# EAGLE design Panel (EAGLE 7.6.0)
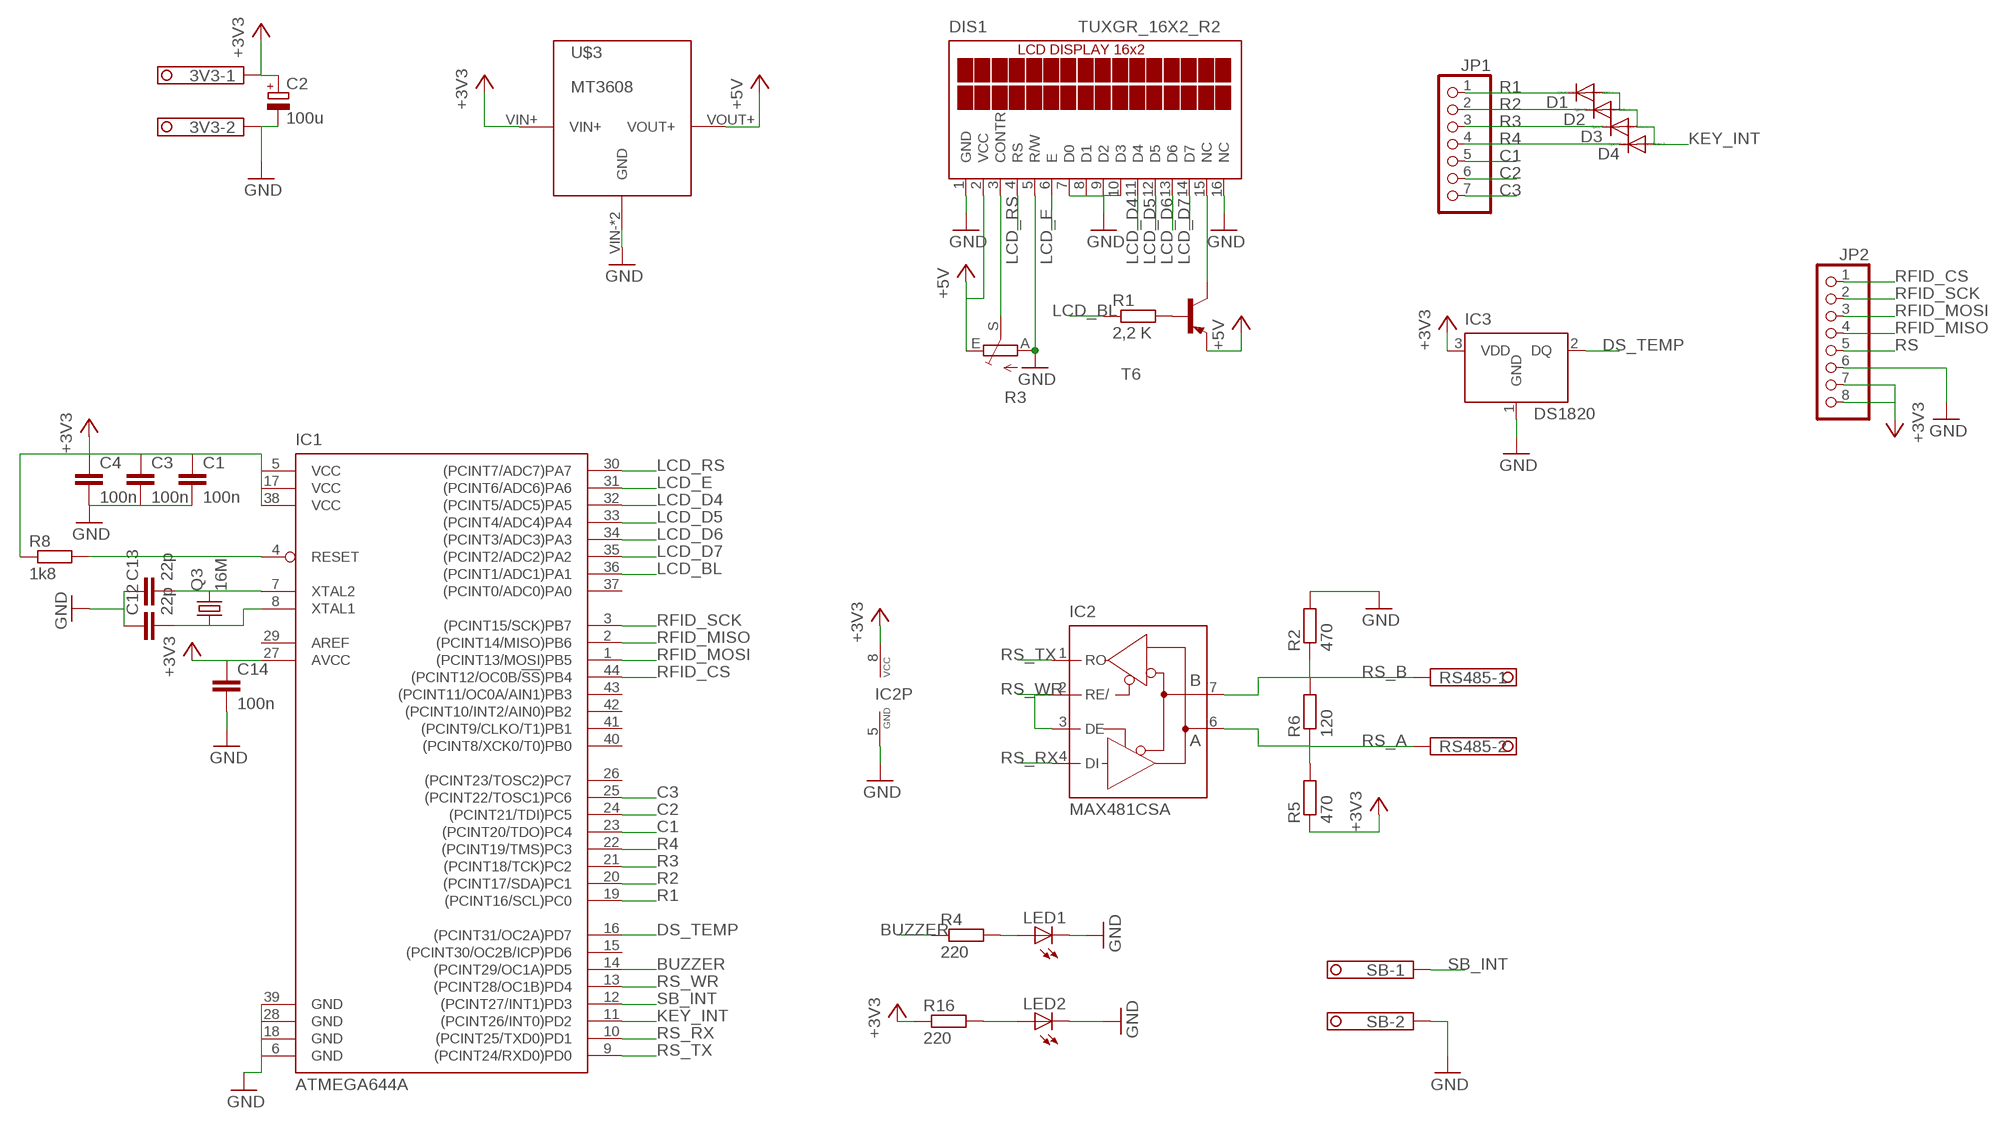
[diagram p0: schematic, sheet 1]

## Parts
3V3  1751248  [1751248]
C1  100n  C-EUC2012  [C2012]
C2  100u  CPOL-EUE2,5-6E  [E2,5-6E]
C3  100n  C-EUC2012  [C2012]
C4  100n  C-EUC2012  [C2012]
C12  22p  C-EU050-024X044  [C050-024X044]
C13  22p  C-EU050-024X044  [C050-024X044]
C14  100n  C-EUC2012  [C2012]
D1  BAS15  [DO34-7]
D2  BAS15  [DO34-7]
D3  BAS15  [DO34-7]
D4  BAS15  [DO34-7]
DIS1  TUXGR_16X2_R2  [TUXGR_16X2_R2]
IC1  ATMEGA644A  [TQFP44]
IC2  MAX481CSA  [SO08]
IC3  DS1820  [TO-92-]
JP1  PINHD-1X7  [1X07]
JP2  PINHD-1X8  [1X08]
LED1  LED3MM  [LED3MM]
LED2  LED3MM  [LED3MM]
Q3  16M  CRYSTALHC49U-V  [HC49U-V]
R1  2,2 K  R-EU_0204/7  [0204/7]
R2  470  R-EU_0204/5  [0204/5]
R3  TRIM_EU-CA6V  [CA6V]
R4  220  R-EU_0204/7  [0204/7]
R5  470  R-EU_0204/5  [0204/5]
R6  120  R-EU_0204/7  [0204/7]
R8  1k8  R-EU_0204/7  [0204/7]
R16  220  R-EU_0204/7  [0204/7]
RS485  1751248  [1751248]
SB  1751248  [1751248]
T6  BC327-40-PNP-TO92-EBC  [TO92-EBC]
U$3  MT3608  [MT3608]

## Nets
+3V3: 3V3.1 C1.1 C2.+ C3.1 C4.1 C14.1 IC1.5(VCC) IC1.17(VCC) IC1.27(AVCC) IC1.38(VCC) IC2.8(VCC) IC3.3(VDD) JP2.7 JP2.8 R5.1 R8.1 R16.1 U$3.VIN+
+5V: DIS1.2(VCC) R3.E T6.E U$3.VOUT+
BUZZER: IC1.14((PCINT29/OC1A)PD5) R4.1
C1: IC1.23((PCINT20/TDO)PC4) JP1.5
C2: IC1.24((PCINT21/TDI)PC5) JP1.6
C3: IC1.25((PCINT22/TOSC1)PC6) JP1.7
DS_TEMP: IC1.16((PCINT31/OC2A)PD7) IC3.2(DQ)
GND: 3V3.2 C1.2 C2.- C3.2 C4.2 C12.1 C13.1 C14.2 DIS1.1(GND) DIS1.5(R/W) DIS1.7(D0) DIS1.8(D1) DIS1.9(D2) DIS1.10(D3) DIS1.16(NC) IC1.6(GND) IC1.18(GND) IC1.28(GND) IC1.39(GND) IC2.5(GND) IC3.1(GND) JP2.6 LED1.K(C) LED2.K(C) R2.2 R3.A SB.2 U$3.VIN-(GND) U$3.VOUT-(GND)
KEY_INT: D1.A D2.A D3.A D4.A IC1.11((PCINT26/INT0)PD2)
LCD_BL: IC1.36((PCINT1/ADC1)PA1) R1.1
LCD_D4: DIS1.11(D4) IC1.32((PCINT5/ADC5)PA5)
LCD_D5: DIS1.12(D5) IC1.33((PCINT4/ADC4)PA4)
LCD_D6: DIS1.13(D6) IC1.34((PCINT3/ADC3)PA3)
LCD_D7: DIS1.14(D7) IC1.35((PCINT2/ADC2)PA2)
LCD_E: DIS1.6(E) IC1.31((PCINT6/ADC6)PA6)
LCD_RS: DIS1.4(RS) IC1.30((PCINT7/ADC7)PA7)
N$1: C12.2 IC1.8(XTAL1) Q3.1
N$2: R1.2 T6.B
N$3: LED1.A R4.2
N$4: C13.2 IC1.7(XTAL2) Q3.2
N$9: DIS1.3(CONTR) R3.S
N$22: DIS1.15(NC) T6.C
N$52: LED2.A R16.2
R1: D1.C IC1.19((PCINT16/SCL)PC0) JP1.1
R2: D2.C IC1.20((PCINT17/SDA)PC1) JP1.2
R3: D3.C IC1.21((PCINT18/TCK)PC2) JP1.3
R4: D4.C IC1.22((PCINT19/TMS)PC3) JP1.4
RFID_CS: IC1.44((PCINT12/OC0B/!SS!)PB4) JP2.1
RFID_MISO: IC1.2((PCINT14/MISO)PB6) JP2.4
RFID_MOSI: IC1.1((PCINT13/MOSI)PB5) JP2.3
RFID_SCK: IC1.3((PCINT15/SCK)PB7) JP2.2
RS: IC1.4(RESET) JP2.5 R8.2
RS_A: IC2.6(A) R5.2 R6.1 RS485.2
RS_B: IC2.7(B) R2.1 R6.2 RS485.1
RS_RX: IC1.10((PCINT25/TXD0)PD1) IC2.4(DI)
RS_TX: IC1.9((PCINT24/RXD0)PD0) IC2.1(RO)
RS_WR: IC1.13((PCINT28/OC1B)PD4) IC2.2(RE/) IC2.3(DE)
SB_INT: IC1.12((PCINT27/INT1)PD3) SB.1
Unconnected: IC1.15((PCINT30/OC2B/ICP)PD6) IC1.26((PCINT23/TOSC2)PC7) IC1.29(AREF) IC1.37((PCINT0/ADC0)PA0) IC1.40((PCINT8/XCK0/T0)PB0) IC1.41((PCINT9/CLKO/T1)PB1) IC1.42((PCINT10/INT2/AIN0)PB2) IC1.43((PCINT11/OC0A/AIN1)PB3)

## Library data of the parts
3V3 RS485 SB = con-phoenix-350:1751248: MKDS 1/ 2-3,5 Printklemme Nennstrom: 10 A Bemessungsspannung: 160 V Raster: 3,5 mm Polzahl: 2 Montageart: Löten Anschlussart: Schraubanschluss Anschlussrichtung vom Leiter zur Platine: 0° Source: http://eshop.phoenixcontact.com .. 1751248.pdf; OC_FARNELL: unknown; OC_NEWARK: unknown
C1 C3 C4 C14 = resistor:C-EU: CAPACITOR, European symbol
C2 = resistor:CPOL-EU: POLARIZED CAPACITOR, European symbol
C12 C13 = rcl:C-EU: CAPACITOR, European symbol
D1-D4 = diode:BAS15: DIODE high speed
DIS1 = display-lcd:TUXGR_16X2_R2: Tuxgraphics LCD display 16x2 characters reflective, without background light Source: tuxgr_12x2_r2.pdf; OC_FARNELL: unknown; OC_NEWARK: unknown
IC1 = atmel:ATMEGA644: 8-bit Microcontroller with 64K Bytes In-System Programmable Flash Source: http://www.atmel.com/dyn/resources/prod_documents/doc2593.pdf; MPN: ATMEGA644PV-10AU; OC_FARNELL: 1455123; OC_NEWARK: 58M3748
IC2 = maxim:MAX481CSA: RS485 TRANSEIVER; MF: MAXIM; MPN: MAX481CSA; OC_FARNELL: unknown; OC_NEWARK: 90C3817
IC3 = DS1820:DS1820: DS1820 - 1-Wire Digital Thermometer
JP1 = pinhead:PINHD-1X7: PIN HEADER
JP2 = pinhead:PINHD-1X8: PIN HEADER
LED1 LED2 = led:LED: LED OSRAM: - CHIPLED LG R971, LG N971, LY N971, LG Q971, LY Q971, LO R971, LY R971 LH N974, LH R974 LS Q976, LO Q976, LY Q976 LO Q996 - Hyper CHIPLED LW Q18S LB Q993, LB Q99A, LB R99A - SideLED LS A670, LO A670, LY A670, LG A670, LP A670 LB A673, LV A673, LT A673, LW A673 LH A674 LY A675 LS A676, LA A676, LO A676, LY A676, LW A676 LS A679, LY A679, LG A679 - Hyper Micro SIDELED® LS Y876, LA Y876, LO Y876, LY Y876 LT Y87S - SmartLED LW L88C, LW L88S LB L89C, LB L89S, LG L890 LS L89K, LO L89K, LY L89K LS L896, LA L896, LO L896, LY L896 - TOPLED LS T670, LO T670, LY T670, LG T670, LP T670 LSG T670, LSP T670, LSY T670, LOP T670, LYG T670 LG T671, LOG T671, LSG T671 LB T673, LV T673, LT T673, LW T673 LH T674 LS T676, LA T676, LO T676, LY T676, LB T676, LH T676, LSB T676, LW T676 LB T67C, LV T67C, LT T67C, LS T67K, LO T67K, LY T67K, LW E67C LS E67B, LA E67B, LO E67B, LY E67B, LB E67C, LV E67C, LT E67C LW T67C LS T679, LY T679, LG T679 LS T770, LO T770, LY T770, LG T770, LP T770 LB T773, LV T773, LT T773, LW T773 LH T774 LS E675, LA E675, LY E675, LS T675 LS T776, LA T776, LO T776, LY T776, LB T776 LHGB T686 LT T68C, LB T68C - Hyper Mini TOPLED® LB M676 - Mini TOPLED Santana® LG M470 LS M47K, LO M47K, LY M47K Source: http://www.osram.convergy.de LUXEON: - LUMILED® LXK2-PW12-R00, LXK2-PW12-S00, LXK2-PW14-U00, LXK2-PW14-V00 LXK2-PM12-R00, LXK2-PM12-S00, LXK2-PM14-U00 LXK2-PE12-Q00, LXK2-PE12-R00, LXK2-PE12-S00, LXK2-PE14-T00, LXK2-PE14-U00 LXK2-PB12-K00, LXK2-PB12-L00, LXK2-PB12-M00, LXK2-PB14-N00, LXK2-PB14-P00, LXK2-PB14-Q00 LXK2-PR12-L00, LXK2-PR12-M00, LXK2-PR14-Q00, LXK2-PR14-R00 LXK2-PD12-Q00, LXK2-PD12-R00, LXK2-PD12-S00 LXK2-PH12-R00, LXK2-PH12-S00 LXK2-PL12-P00, LXK2-PL12-Q00, LXK2-PL12-R00 Source: www.luxeon.com KINGBRIGHT: KA-3528ASYC Source: www.kingbright.com
Q3 = crystal:CRYSTAL: CRYSTAL; OC_FARNELL: 1666969; OC_NEWARK: unknown
R1 R2 R4-R6 R8 R16 = resistor:R-EU_: RESISTOR, European symbol
R3 = pot:TRIM_EU-: POTENTIOMETER
T6 = transistor:*-PNP-: PNP Transistror
U$3 = dc-dc-converter2:MT3608

## Board
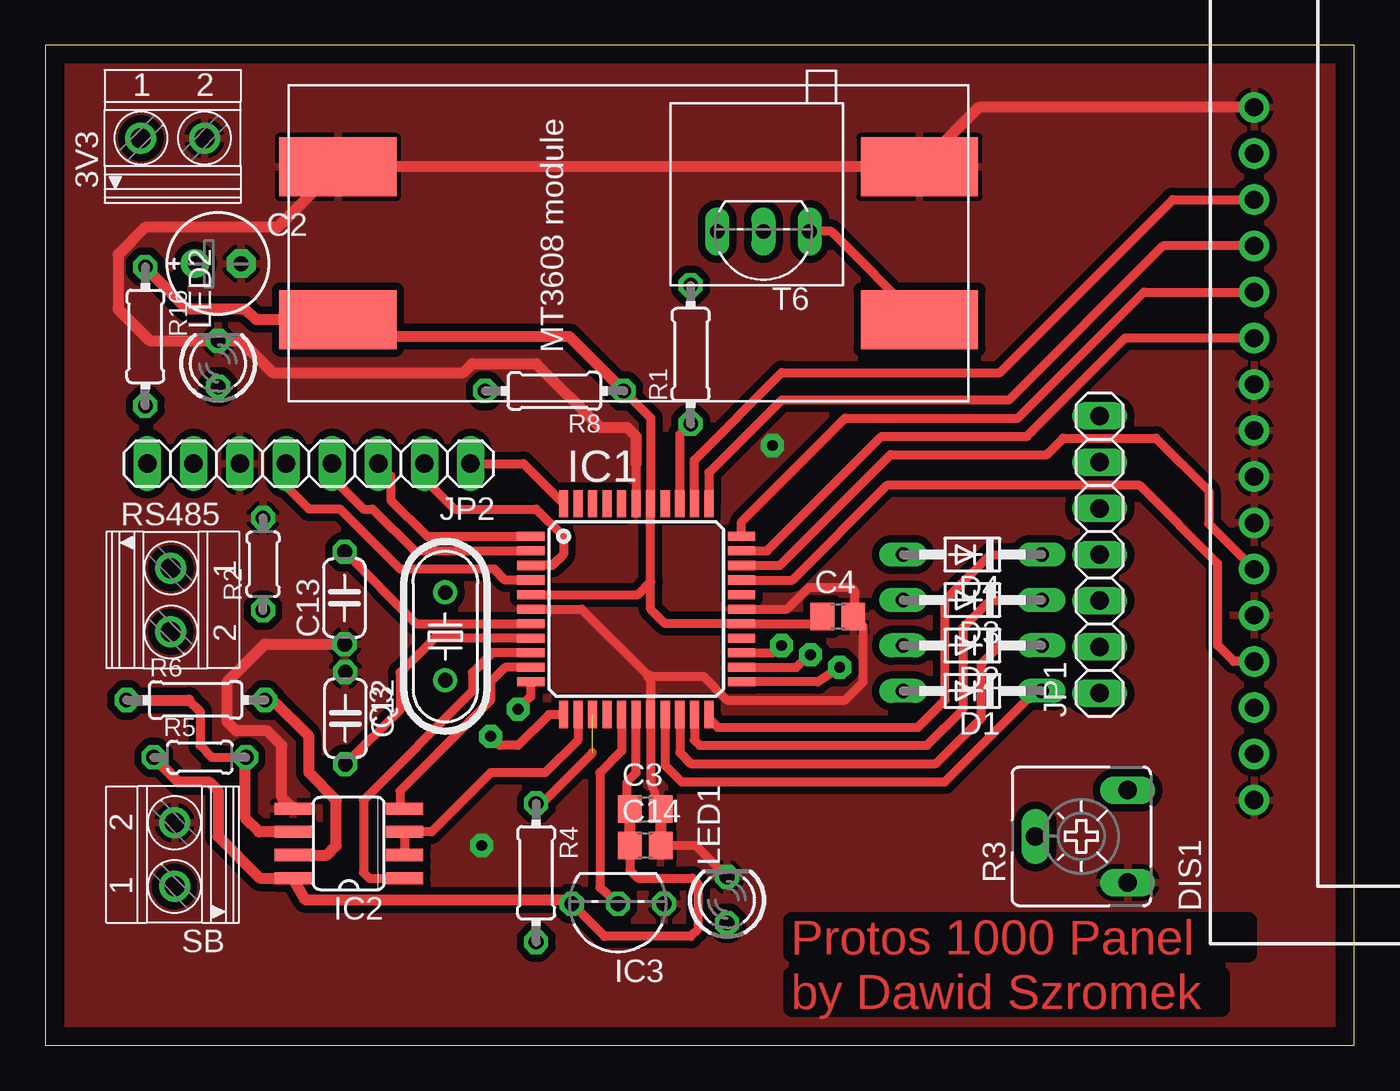
[diagram p1: board, top side]
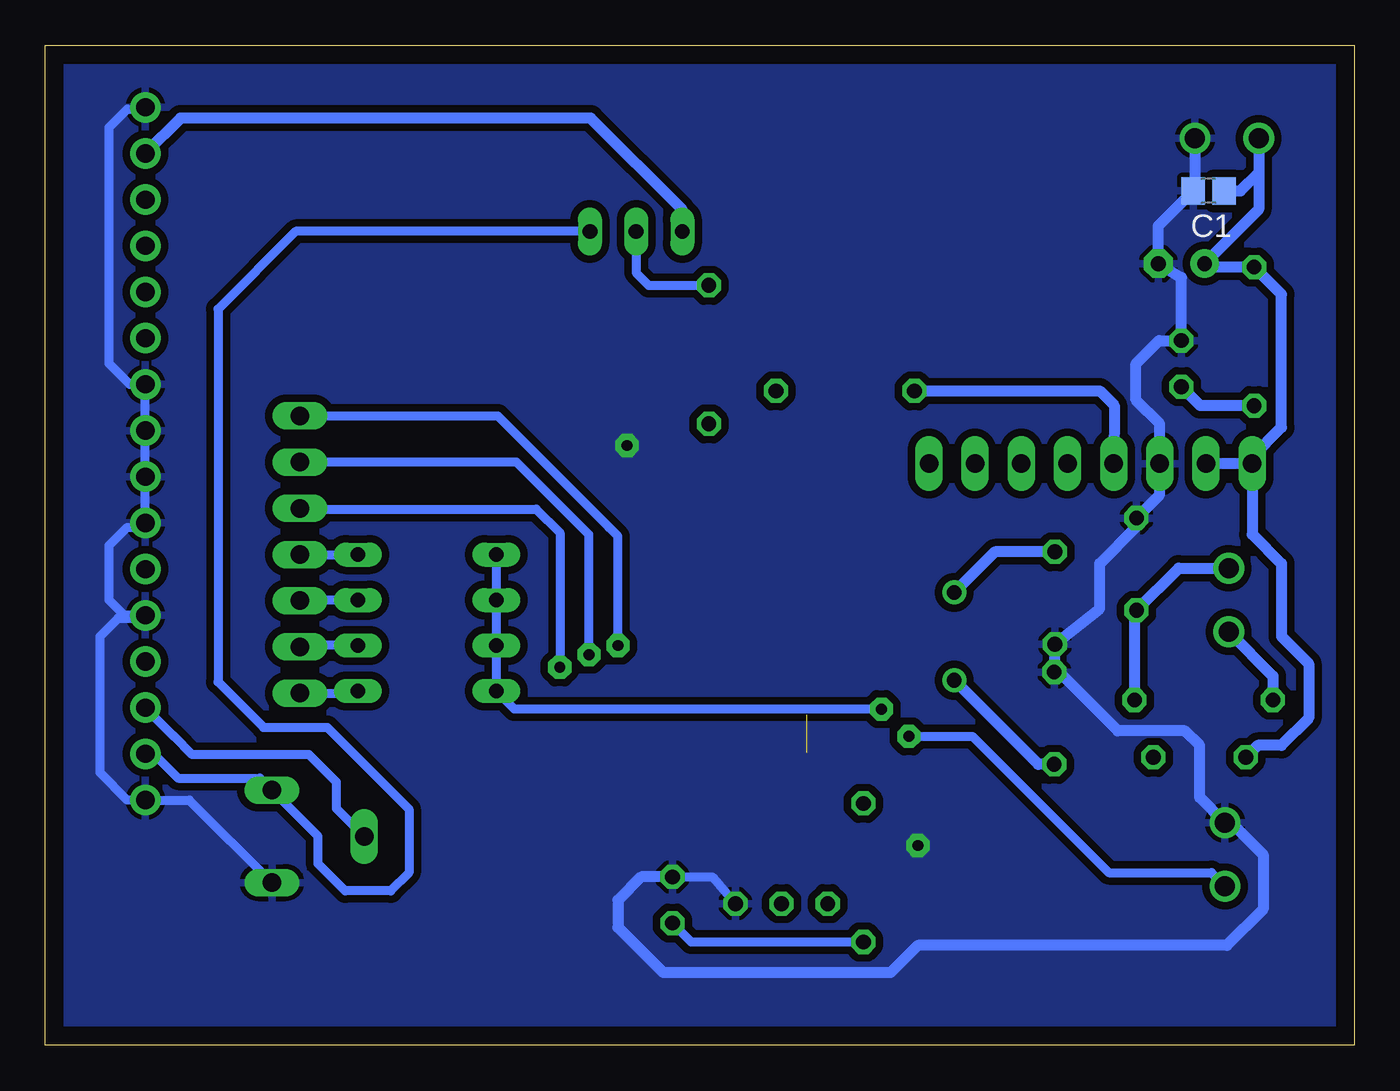
[diagram p2: board, bottom side, seen from below]

Size 72 x 55 mm. Coordinates in mm from the lower left corner, seen from the top.
Outline: 0,0 72,0 72,55 0,55 0,0
Copper layers (1*16): Top 0.035mm / dielectric 1.5mm / Bottom 0.035mm
Design rules "default": minimum track width 10mil, minimum drill 24mil, track to track 8mil, track to pad 8mil, pad to pad 8mil, via to via 8mil, smd to smd 8mil, copper to edge 40mil, drill to drill 8mil, minimum pad ring 10mil, minimum via ring 8mil, stop-mask expansion 4mil, vias tented up to drill 0mil, thermal gap 10mil

### Footprints (pad centres in the part's own frame; a part is rotated, then mirrored left to right if it is on the bottom)
1751248 = drill 1.1 pad 1.7: 1 -1.75,-0.1; 2 1.75,-0.1
C2012 = smd 1.3 x 1.5: 1 -0.85,0; 2 0.85,0
E2,5-6E = drill 0.813 pad 1.575: + -1.27,0 | drill 0.813 pad 1.575 octagon: - 1.27,0
C050-024X044 = drill 0.813 octagon: 1 -2.54,0; 2 2.54,0
DO34-7 = drill 0.813 long: A 3.81,0; C -3.81,0
TUXGR_16X2_R2 = drill 1 pad 1.676: 1 -32,15.5; 2 -29.46,15.5; 3 -26.92,15.5; 4 -24.38,15.5; 5 -21.84,15.5; 6 -19.3,15.5; 7 -16.76,15.5; 8 -14.22,15.5; 9 -11.68,15.5; 10 -9.14,15.5; 11 -6.6,15.5; 12 -4.06,15.5; 13 -1.52,15.5; 14 1.02,15.5; 15 3.56,15.5; 16 6.1,15.5
TQFP44 = smd 1.5 x 0.5: 1 -5.8,4; 2 -5.8,3.2; 3 -5.8,2.4; 4 -5.8,1.6; 5 -5.8,0.8; 6 -5.8,0; 7 -5.8,-0.8; 8 -5.8,-1.6; 9 -5.8,-2.4; 10 -5.8,-3.2; 11 -5.8,-4; 23 5.8,-4; 24 5.8,-3.2; 25 5.8,-2.4; 26 5.8,-1.6; 27 5.8,-0.8; 28 5.8,0; 29 5.8,0.8; 30 5.8,1.6; 31 5.8,2.4; 32 5.8,3.2; 33 5.8,4 | smd 0.5 x 1.5: 12 -4,-5.8; 13 -3.2,-5.8; 14 -2.4,-5.8; 15 -1.6,-5.8; 16 -0.8,-5.8; 17 0,-5.8; 18 0.8,-5.8; 19 1.6,-5.8; 20 2.4,-5.8; 21 3.2,-5.8; 22 4,-5.8; 34 4,5.8; 35 3.2,5.8; 36 2.4,5.8; 37 1.6,5.8; 38 0.8,5.8; 39 0,5.8; 40 -0.8,5.8; 41 -1.6,5.8; 42 -2.4,5.8; 43 -3.2,5.8; 44 -4,5.8
SO08 = smd 0.66 x 2.032: 1 -1.905,-3.073; 2 -0.635,-3.073; 3 0.635,-3.073; 4 1.905,-3.073; 5 1.905,3.073; 6 0.635,3.073; 7 -0.635,3.073; 8 -1.905,3.073
TO-92- = drill 0.813 octagon: 1 -2.54,0; 2 0,0; 3 2.54,0
1X07 = drill 1.016 long: 1 -7.62,0; 2 -5.08,0; 3 -2.54,0; 4 0,0; 5 2.54,0; 6 5.08,0; 7 7.62,0
1X08 = drill 1.016 long: 1 -8.89,0; 2 -6.35,0; 3 -3.81,0; 4 -1.27,0; 5 1.27,0; 6 3.81,0; 7 6.35,0; 8 8.89,0
LED3MM = drill 0.813 octagon: A -1.27,0; K 1.27,0
HC49U-V = drill 0.813: 1 -2.413,0; 2 2.413,0
0204/7 = drill 0.813 octagon: 1 -3.81,0; 2 3.81,0
0204/5 = drill 0.813 octagon: 1 -2.54,0; 2 2.54,0
CA6V = drill 1.016 long: A -2.54,-2.54; E 2.54,-2.54; S 0,2.54
TO92-EBC = drill 0.813 long: B 0,-1.27; C 2.54,-1.27; E -2.54,-1.27
MT3608 = smd 3.251 x 6.452: VIN+ -4.2,16; VIN- 4.2,16; VOUT+ -4.2,-16; VOUT- 4.2,-16

### Placement (x,y rotation side)
3V3  7,50 0 top
C1  8,47 180 bottom
C2  9.5,43 0 top
C3  33,13 0 top
C4  43.6,23.6 0 top
C12  16.5,18 270 top
C13  16.45,24.61 90 top
C14  33,11 0 top
D1  51,19.5 180 top
D2  51,22 180 top
D3  51,24.5 180 top
D4  51,27 180 top
DIS1  82,45.5 90 top
IC1  32.5,24 0 top
IC2  16.69,11.11 90 top
IC3  31.5,7.8 180 top
JP1  58,27 90 top
JP2  14.5,32 180 top
LED1  37.5,8 90 top
LED2  9.5,37.5 90 top
Q3  22,22.5 90 top
R1  35.5,38 90 top
R2  11.97,26.47 90 top
R3  57,11.5 90 top
R4  27,9.5 270 top
R5  8.5,15.85 0 top
R6  8.27,19 0 top
R8  28,36 180 top
R16  5.5,39 270 top
RS485  7,24.5 270 top
SB  7,10.5 90 top
T6  39.5,43.5 180 top
U$3  32.09,44.12 90 top

### Tracks (layer width: path | path; a pad name or v marks a point on that pad's centre or on a via)
+3V3
  Top 0.508: R8.1 33.3,34.51 IC1.38 33.3,25.5 | C3.1 32.15,13.15 32,13.5 32,14.5 32.5,15 IC1.17 | C4.1 42.75,23.2 IC1.27 34.1,23.2 33.3,24 33.3,25.5 | C14.1 32.15,9.65 32.6,9.2 35.6,9.2 35.9,8.9 35.9,6.4 35.5,6 30.76,6 IC3.3 | IC1.5 32.6,24.8 33.3,25.5
  Top 0.61: R5.1 7.31,14.5 9,14.5 9.5,14 9.5,11.5 11.79,9.2 IC2.8 14.32,8 29,8 IC3.3 | R16.1 7.81,40.5 11,40.5 11.58,39.92 U$3.VIN+ 17.01,39 28.81,39 R8.1 | C14.1 C3.1
  Bottom 0.61: 3V3.1 5.25,48 | 5.25,48 5.25,45.98 C2.+ 7.54,42.81 R16.1 4,41.31 4,34 5.61,32.39 JP2.8 | C1.1 6.25,47 5.25,48 | JP2.8 JP2.7 | JP2.8 5.61,28.11 4,26.5 4,22.5 2.5,21 2.5,18 4,16.5 5.31,16.5 R5.1
+5V
  Top 0.508: U$3.VOUT+ 43.24,44.77 T6.E
  Bottom 0.508: T6.E 58.23,44.77 62.5,40.5 62.5,20 60,17.5 56.5,17.5 52,13 52,9.5 53,8.5 55.5,8.5 57,10 57,11.5 R3.E 60.2,14.7 64.7,14.7 66.04,16.04 DIS1.2
BUZZER  (1 unrouted)
  Top 0.508: 30.1,16.1 27.5,13.5 27.19,13.5 R4.1
C1  (via drill 0.6 pad 1.27)
  Top 0.508: v43.7,20.8 42.5,20 IC1.23
  Bottom 0.508: JP1.5 57.96,29.5 45,29.5 43.7,28.2 v43.7,20.8
C2  (via drill 0.6 pad 1.27)
  Top 0.508: IC1.24 41.3,20.8 v42.1,21.5
  Bottom 0.508: v42.1,21.5 42.1,28.1 46.08,32.08 JP1.6
C3  (via drill 0.6 pad 1.27)
  Top 0.508: IC1.25 40.1,21.6 v40.5,22
  Bottom 0.508: JP1.7 47.12,34.62 41.5,29 41,28.5 40.5,28 v40.5,22
DS_TEMP
  Top 0.508: IC1.16 31.7,16.2 30.5,15 30.5,8.7 IC3.2
GND  (via drill 0.6 pad 1.27)
  Top 0.508: IC1.6 29.5,24 33.2,20.3 | C3.2 33.3,14.45 IC1.18 33.3,20.3 36.2,20.3 37.5,19 44,19 45,20 45,23.05 C4.2 44.5,23.65 44.5,25 44.3,25.2 42,25.2 40.8,24 IC1.28 | 32.5,32 IC1.39 | C14.2 35.77,11 LED1.K
  Top 0.61: IC2.5 13,13.63 13,16.5 12.2,17.3 10.5,17.3 10,17.8 10,20 12.07,22.07 C13.1 | DIS1.16 51.37,51.6 U$3.VOUT- U$3.VIN- 12.77,45 5.5,45 4,43.5 4,40.5 5.73,38.77 LED2.K 10.73,38.77 12.5,37 23,37 23.5,37.5 27,37.5 30.5,34 32,34 32.5,33.5 32.5,32 | C3.2 C14.2 | 33.3,20.3 33.2,20.3
  Bottom 0.508: R3.A 64.08,13.5 DIS1.1 67.5,13.5 69,15 69,22.5 68,23.5 66.66,23.5 DIS1.5 67.66,23.66 68.5,24.5 68.5,27.5 67.5,28.5 66.74,28.5 DIS1.7 DIS1.8 DIS1.9 DIS1.10 67.36,36.36 68.5,37.5 68.5,50.5 67.5,51.5 66.6,51.5 DIS1.16 | LED1.K 35.31,9.27 IC3.1
  Bottom 0.61: 3V3.2 8.75,47.1 C1.2 10.77,45.08 C2.- 9.5,42.23 LED2.K 10.73,38.77 12,37.5 12,35.5 10.69,34.19 JP2.6 10.69,30.29 R2.2 11.97,28.53 14,26.5 14,24.03 C13.1 16.45,20.58 C12.1 16,20.3 13,17.3 9.3,17.3 8.5,16.5 8.5,13.65 SB.2 6.75,12.25 5,10.5 5,7.5 7,5.5 24,5.5 25.5,4 38,4 40.5,6.5 40.5,8 39.23,9.27 LED1.K
  other vias: 40,33 24,11
  pour Top (isolate 0.406): 1,55 72,55 72,0 1,0
  pour Bottom (isolate 0.406): 1,55 72,55 72,1 1,1
KEY_INT  (via drill 0.6 pad 1.27)
  Top 0.508: IC1.11 26.7,19.2 v26,18.5
  Bottom 0.508: D4.A D3.A D2.A D1.A 46.19,18.5 v26,18.5
LCD_BL
  Top 0.508: IC1.36 34.9,33.59 R1.1
LCD_D4
  Top 0.508: DIS1.11 59.4,38.9 54.25,33.75 54,33.5 46,33.5 39.7,27.2 IC1.32
LCD_D5
  Top 0.508: IC1.33 38.3,28.8 44,34.5 53.5,34.5 60.44,41.44 DIS1.12
LCD_D6
  Top 0.508: DIS1.13 61.48,43.98 53,35.5 40.5,35.5 36.5,31.5 IC1.34
LCD_D7
  Top 0.508: IC1.35 35.7,32.2 40.5,37 52.5,37 62.02,46.52 DIS1.14
LCD_E
  Top 0.508: IC1.31 40.4,26.4 46.5,32.5 55.1,32.5 56,33.4 61.1,33.4 64,30.5 64,28.7 DIS1.6
LCD_RS
  Top 0.508: DIS1.4 65.38,21.12 64.5,22 64.5,26.5 60.2,30.8 46.3,30.8 41.1,25.6 IC1.30
N$1
  Top 0.508: IC1.8 21.4,22.4 19.5,20.5 19.5,18.46 C12.2
  Bottom 0.61: C12.2 17.37,15.46 Q3.1
N$2
  Bottom 0.508: T6.B 39.5,42.5 38.81,41.81 R1.2
N$3
  Bottom 0.508: R4.2 36.46,5.69 LED1.A
N$4
  Top 0.508: C13.2 20.41,23.2 IC1.7
  Bottom 0.61: C13.2 19.76,27.15 Q3.2
N$9
  Bottom 0.508: DIS1.3 64.96,17.04 64.92,17 63.92,16 57.5,16 56,14.5 56,13.04 R3.S
N$22
  Bottom 0.61: T6.C 36.96,45.96 42,51 64.56,51 DIS1.15
N$52
  Bottom 0.61: R16.2 8.46,35.19 LED2.A
R1
  Top 0.508: IC1.19 34.1,15.4 35,14.5 49.5,14.5 54.5,19.5 D1.C | D1.C 55.38,19.5 55.5,19.38 54.93,19.38 D1.C
  Bottom 0.508: JP1.1 54.93,19.38 D1.C
R2
  Top 0.508: IC1.20 34.9,16.1 35.5,15.5 49,15.5 51.5,18 51.5,21 52.5,22 D2.C
  Bottom 0.508: D2.C 57.92,22 JP1.2
R3
  Top 0.508: IC1.21 35.7,16.8 36,16.5 48.5,16.5 50.5,18.5 50.5,23 52,24.5 D3.C
  Bottom 0.508: D3.C 57.96,24.5 JP1.3
R4
  Top 0.508: D4.C 52,27 49.5,24.5 49.5,19 48,17.5 37,17.5 36.5,18 IC1.22
  Bottom 0.508: JP1.4 D4.C
RFID_CS
  Top 0.508: JP2.1 26.3,32 IC1.44
RFID_MISO
  Top 0.508: JP2.4 16,31.77 16,31 17.5,29.5 18,29.5 20.3,27.2 IC1.2
RFID_MOSI
  Top 0.508: JP2.3 19,31.31 19,30 21,28 IC1.1
RFID_SCK
  Top 0.508: JP2.2 20.85,31.15 22.5,29.5 27,29.5 28.5,28 28.5,27 27.9,26.4 IC1.3
RS
  Top 0.508: IC1.4 25.3,25.6 24.7,26.2 19.5,26.2 16.2,29.5 14.5,29.5 13.23,30.77 JP2.5
  Bottom 0.61: R8.2 14,36 13.2,35.2 JP2.5
RS_A
  Top 0.508: 7.89,19 8.5,18.39 8.5,16.5 9.15,15.85 R5.2
  Top 0.61: IC2.6 11.76,11.74 11,12.5 11,15.81 R5.2 | R6.1 7.89,19
  Bottom 0.61: RS485.2 4.46,20.31 R6.1
RS_B
  Top 0.61: IC2.7 15.47,10.48 16,11 16,13.5 14.5,15 14.5,17 12.5,19 R6.2
  Bottom 0.61: R6.2 12.08,23.82 R2.1 9.65,26.25 RS485.1
RS_RX
  Top 0.508: IC1.10 25.3,20.8 24.5,20 24.5,19 19.5,14 19.5,13.28 IC2.4
RS_TX
  Top 0.508: IC1.9 24.6,21.6 23.5,20.5 23.5,19.5 17.5,13.5 17.5,9.5 17.8,9.2 IC2.1
RS_WR
  Top 0.508: IC2.2 IC2.3 21.25,11.74 24.5,15 27.5,15 29.3,16.8 IC1.13
SB_INT  (via drill 0.6 pad 1.27)
  Top 0.508: IC1.12 27.7,18.2 26,16.5 25,16.5 v24.5,17
  Bottom 0.508: v24.5,17 21,17 13.5,9.5 7.85,9.5 SB.1

### Text on the board
Top: Protos 1000 Panel | by Dawid Szromek